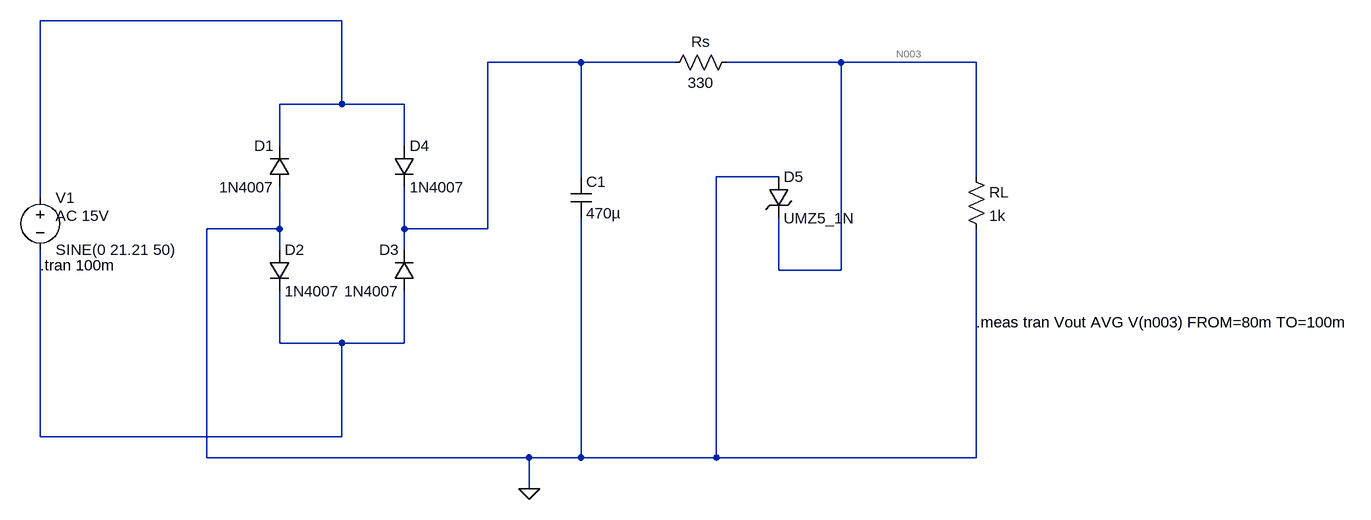
[diagram p0: schematic Regulated_DC_Power_Supply.asc]
Regulated_DC_Power_Supply.asc, the LTspice schematic file:
Version 4.1
SHEET 1 2148 680
WIRE 544 -4624 80 -4624
WIRE 912 -4560 768 -4560
WIRE 1056 -4560 912 -4560
WIRE 1312 -4560 1136 -4560
WIRE 1520 -4560 1312 -4560
WIRE 544 -4496 544 -4624
WIRE 544 -4496 448 -4496
WIRE 640 -4496 544 -4496
WIRE 448 -4432 448 -4496
WIRE 640 -4432 640 -4496
WIRE 912 -4384 912 -4560
WIRE 1216 -4384 1120 -4384
WIRE 1520 -4384 1520 -4560
WIRE 80 -4352 80 -4624
WIRE 448 -4304 448 -4368
WIRE 448 -4304 336 -4304
WIRE 640 -4304 640 -4368
WIRE 768 -4304 768 -4560
WIRE 768 -4304 640 -4304
WIRE 448 -4272 448 -4304
WIRE 640 -4272 640 -4304
WIRE 1216 -4240 1216 -4320
WIRE 1312 -4240 1312 -4560
WIRE 1312 -4240 1216 -4240
WIRE 448 -4128 448 -4208
WIRE 544 -4128 448 -4128
WIRE 640 -4128 640 -4208
WIRE 640 -4128 544 -4128
WIRE 80 -3984 80 -4272
WIRE 544 -3984 544 -4128
WIRE 544 -3984 80 -3984
WIRE 336 -3952 336 -4304
WIRE 832 -3952 336 -3952
WIRE 912 -3952 912 -4320
WIRE 912 -3952 832 -3952
WIRE 1120 -3952 1120 -4384
WIRE 1120 -3952 912 -3952
WIRE 1520 -3952 1520 -4304
WIRE 1520 -3952 1120 -3952
WIRE 832 -3904 832 -3952
FLAG 832 -3904 0
SYMBOL voltage 80 -4368 R0
WINDOW 123 24 44 Left 2
WINDOW 39 0 0 Left 0
SYMATTR Value2 AC 15V
SYMATTR InstName V1
SYMATTR Value SINE(0 21.21 50)
SYMBOL diode 432 -4272 R0
SYMATTR InstName D2
SYMATTR Value 1N4007
SYMBOL diode 656 -4208 R180
WINDOW 0 24 64 Left 2
WINDOW 3 24 0 Left 2
SYMATTR InstName D3
SYMATTR Value 1N4007
SYMBOL diode 624 -4432 R0
SYMATTR InstName D4
SYMATTR Value 1N4007
SYMBOL diode 464 -4368 R180
WINDOW 0 24 64 Left 2
WINDOW 3 24 0 Left 2
SYMATTR InstName D1
SYMATTR Value 1N4007
SYMBOL res 1152 -4576 R90
WINDOW 0 0 56 VBottom 2
WINDOW 3 32 56 VTop 2
SYMATTR InstName Rs
SYMATTR Value 330
SYMBOL cap 896 -4384 R0
SYMATTR InstName C1
SYMATTR Value 470µ
SYMBOL res 1504 -4400 R0
SYMATTR InstName RL
SYMATTR Value 1k
SYMBOL zener 1200 -4384 R0
SYMATTR InstName D5
SYMATTR Value UMZ5_1N
SYMATTR Description Diode
SYMATTR Type diode
TEXT 80 -4248 Left 2 !.tran 100m
TEXT 1520 -4160 Left 2 !.meas tran Vout AVG V(n003) FROM=80m TO=100m

The netlist it stands for:
* Regulated_DC_Power_Supply.asc
V1 N001 N004 SINE(0 21.21 50) AC 15V
D2 0 N004 1N4007
D3 N004 N002 1N4007
D4 N001 N002 1N4007
D1 0 N001 1N4007
Rs N003 N002 330
C1 N002 0 470µ
RL N003 0 1k
D5 0 N003 UMZ5_1N
.model D D
.lib standard.dio
.tran 100m
.meas tran Vout AVG V(n003) FROM=80m TO=100m
.backanno
.end